# Altium schematic sheet LV_Board.SchDoc
size A4; SheetNumber: 1; SheetTotal: 1
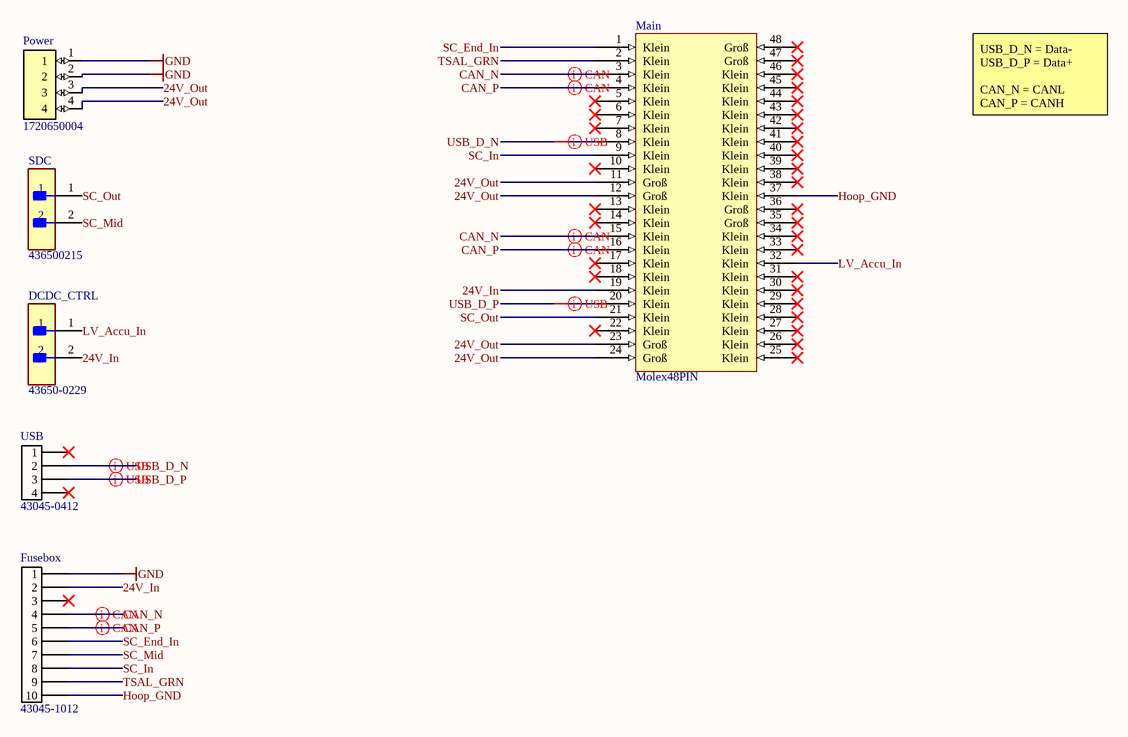
[diagram p0: LV_Board.SchDoc]

## Parts
DCDC_CTRL  43650-0229  [436500229]
Fusebox  43045-1012  [43045-1012]
Main  Molex48PIN  [Molex 48 Pin Header CMC/CMX]
Power  1720650004  [1720650004]
SDC  436500215  [436500215]
USB  43045-0412  [43045-0412]

## Nets
GND: Fusebox.1 Power.1 Power.2
24V_In: DCDC_CTRL.2 Fusebox.2 Main.19(Klein)
24V_Out: Main.11(Groß) Main.12(Groß) Main.23(Groß) Main.24(Groß) Power.3 Power.4
CAN_N: Fusebox.4 Main.3(Klein) Main.15(Klein)
CAN_P: Fusebox.5 Main.4(Klein) Main.16(Klein)
Hoop_GND: Fusebox.10 Main.37(Klein)
LV_Accu_In: DCDC_CTRL.1 Main.32(Klein)
SC_End_In: Fusebox.6 Main.1(Klein)
SC_In: Fusebox.8 Main.9(Klein)
SC_Mid: Fusebox.7 SDC.2
SC_Out: Main.21(Klein) SDC.1
TSAL_GRN: Fusebox.9 Main.2(Klein)
USB_D_N: Main.8(Klein) USB.2
USB_D_P: Main.20(Klein) USB.3

Not connected (* = marked no-connect by the designer): Fusebox 3*; Main 5(Klein)* 6(Klein)* 7(Klein)* 10(Klein)* 13(Klein)* 14(Klein)* 17(Klein)* 18(Klein)* 22(Klein)* 25(Klein)* 26(Klein)* 27(Klein)* 28(Klein)* 29(Klein)* 30(Klein)* 31(Klein)* 33(Klein)* 34(Klein)* 35(Groß)* 36(Groß)* 38(Klein)* 39(Klein)* 40(Klein)* 41(Klein)* 42(Klein)* 43(Klein)* 44(Klein)* 45(Klein)* 46(Klein)* 47(Groß)* 48(Groß)*; USB 1* 4*

## Layout directives
differential pair: CAN_N, CAN_P, USB_D_N, USB_D_P

## Notes on the sheet
- USB_D_N = Data-
  USB_D_P = Data+
  CAN_N = CANL
  CAN_P = CANH

## Library data of the parts
DCDC_CTRL = 43650-0229: Micro-Fit 3.0 Vertical Header, 3.00mm Pitch, Single Row, 2 Circuits; ComponentLink1Description: Molex; ComponentLink1URL: https://www.molex.com/molex/products/part-detail/pcb_headers/0436500229
Fusebox = 43045-1012: Micro-Fit 3.0 Vertical Header, 3.00mm Pitch, Dual Row, 10 Circuits, with PCB Polarizing Peg, Tin, Glow-Wire Capable, Black
Power = 1720650004: Mega-Fit Vertical Header, Through Hole, 5.70mm Pitch, Dual Row, 4 Circuits, 0.38µm
SDC = 436500215: Micro-Fit 3.0 Vertical Header, 3.00mm Pitch, Single Row, 2 Circuits
USB = 43045-0412: Micro-Fit 3.0 Vertical Header, 3.00mm Pitch, Dual Row, 4 Circuits, with PCB Polarizing Peg, Tin, Glow-Wire Capable, Black